# Altium schematic sheet FPGA_DDR.SchDoc
size A4; SheetNumber: 2; SheetTotal: 9
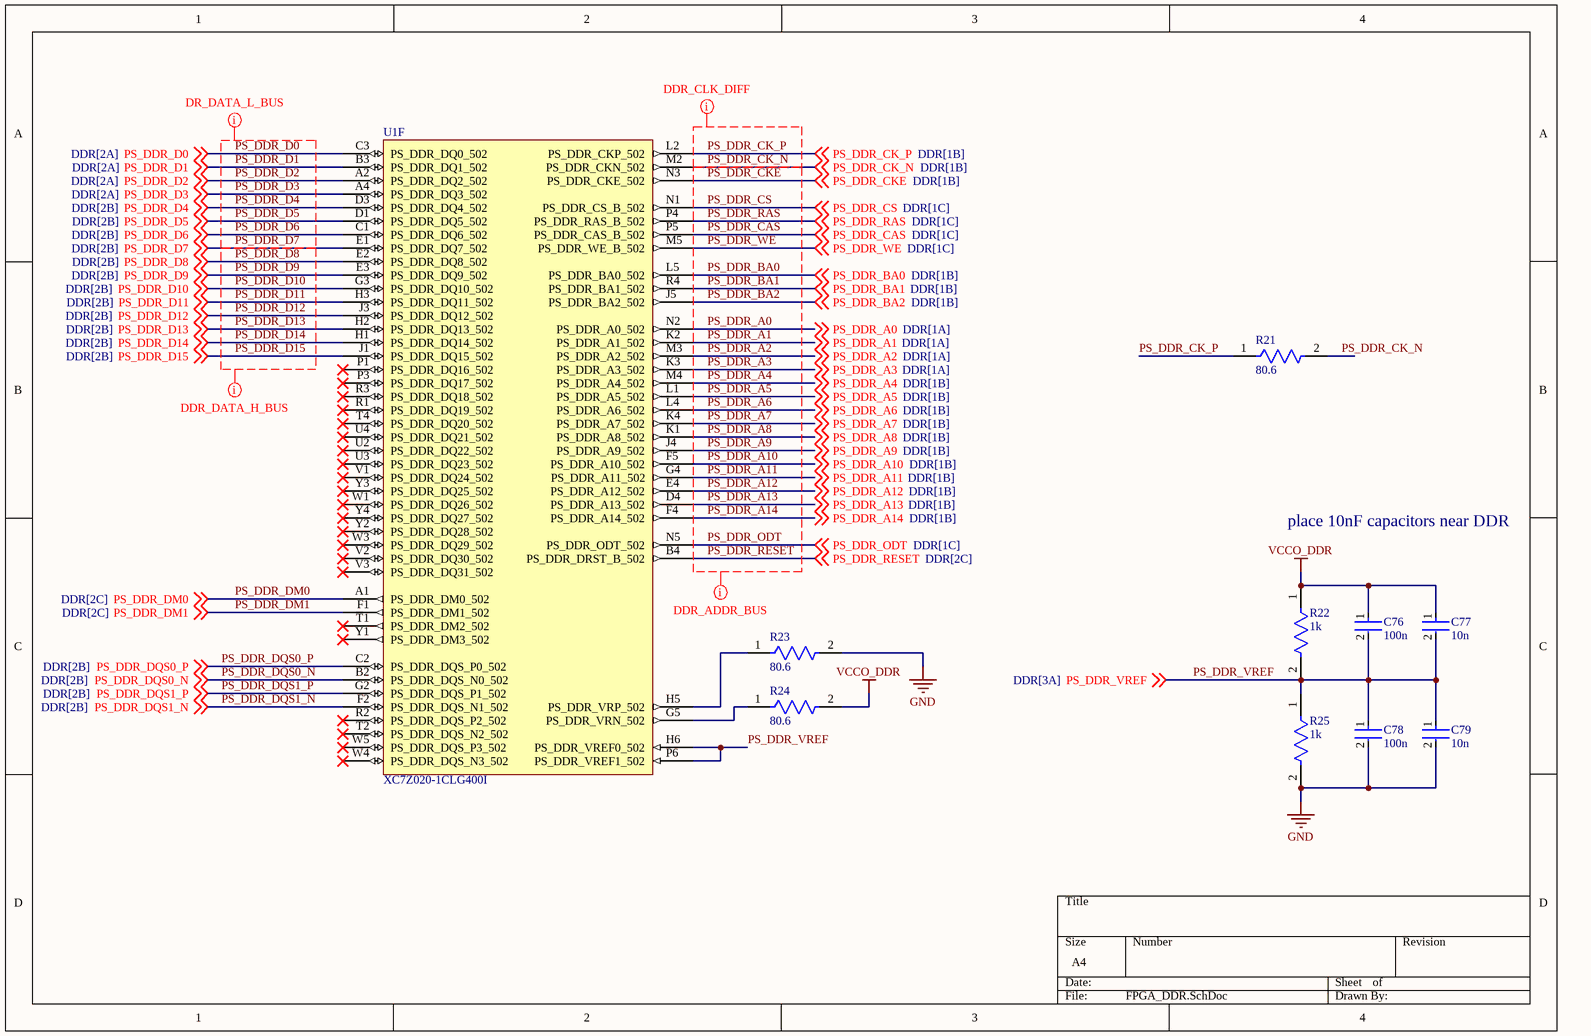
[diagram p0: FPGA_DDR.SchDoc]

## Parts
C76  100n  [FP-CC0603-DA-MFG]
C77  10n  [FP-CC0603-DA-MFG]
C78  100n  [FP-CC0603-DA-MFG]
C79  10n  [FP-CC0603-DA-MFG]
R21  80.6  [FP-RT0402-MFG]
R22  1k  [FP-RC0603-0_55-IPC_C]
R23  80.6  [FP-RT0603-MFG]
R24  80.6  [FP-RT0603-MFG]
R25  1k  [FP-RC0603-0_55-IPC_C]
U1  XC7Z020-1CLG400I  [CLG400]  (part F of 9)

## Nets
GND: C78.2 C79.2 R23.2 R25.2
VCCO_DDR: C76.1 C77.1 R22.1 R24.2
PS_DDR_A0: U1.N2(PS_DDR_A0_502) ; off-sheet PS_DDR_A0
PS_DDR_A1: U1.K2(PS_DDR_A1_502) ; off-sheet PS_DDR_A1
PS_DDR_A2: U1.M3(PS_DDR_A2_502) ; off-sheet PS_DDR_A2
PS_DDR_A3: U1.K3(PS_DDR_A3_502) ; off-sheet PS_DDR_A3
PS_DDR_A4: U1.M4(PS_DDR_A4_502) ; off-sheet PS_DDR_A4
PS_DDR_A5: U1.L1(PS_DDR_A5_502) ; off-sheet PS_DDR_A5
PS_DDR_A6: U1.L4(PS_DDR_A6_502) ; off-sheet PS_DDR_A6
PS_DDR_A7: U1.K4(PS_DDR_A7_502) ; off-sheet PS_DDR_A7
PS_DDR_A8: U1.K1(PS_DDR_A8_502) ; off-sheet PS_DDR_A8
PS_DDR_A9: U1.J4(PS_DDR_A9_502) ; off-sheet PS_DDR_A9
PS_DDR_A10: U1.F5(PS_DDR_A10_502) ; off-sheet PS_DDR_A10
PS_DDR_A11: U1.G4(PS_DDR_A11_502) ; off-sheet PS_DDR_A11
PS_DDR_A12: U1.E4(PS_DDR_A12_502) ; off-sheet PS_DDR_A12
PS_DDR_A13: U1.D4(PS_DDR_A13_502) ; off-sheet PS_DDR_A13
PS_DDR_A14: U1.F4(PS_DDR_A14_502) ; off-sheet PS_DDR_A14
PS_DDR_BA0: U1.L5(PS_DDR_BA0_502) ; off-sheet PS_DDR_BA0
PS_DDR_BA1: U1.R4(PS_DDR_BA1_502) ; off-sheet PS_DDR_BA1
PS_DDR_BA2: U1.J5(PS_DDR_BA2_502) ; off-sheet PS_DDR_BA2
PS_DDR_CAS: U1.P5(PS_DDR_CAS_B_502) ; off-sheet PS_DDR_CAS
PS_DDR_CK_N: R21.2 U1.M2(PS_DDR_CKN_502) ; off-sheet PS_DDR_CK_N
PS_DDR_CK_P: R21.1 U1.L2(PS_DDR_CKP_502) ; off-sheet PS_DDR_CK_P
PS_DDR_CKE: U1.N3(PS_DDR_CKE_502) ; off-sheet PS_DDR_CKE
PS_DDR_CS: U1.N1(PS_DDR_CS_B_502) ; off-sheet PS_DDR_CS
PS_DDR_D0: U1.C3(PS_DDR_DQ0_502) ; off-sheet PS_DDR_D0
PS_DDR_D1: U1.B3(PS_DDR_DQ1_502) ; off-sheet PS_DDR_D1
PS_DDR_D2: U1.A2(PS_DDR_DQ2_502) ; off-sheet PS_DDR_D2
PS_DDR_D3: U1.A4(PS_DDR_DQ3_502) ; off-sheet PS_DDR_D3
PS_DDR_D4: U1.D3(PS_DDR_DQ4_502) ; off-sheet PS_DDR_D4
PS_DDR_D5: U1.D1(PS_DDR_DQ5_502) ; off-sheet PS_DDR_D5
PS_DDR_D6: U1.C1(PS_DDR_DQ6_502) ; off-sheet PS_DDR_D6
PS_DDR_D7: U1.E1(PS_DDR_DQ7_502) ; off-sheet PS_DDR_D7
PS_DDR_D8: U1.E2(PS_DDR_DQ8_502) ; off-sheet PS_DDR_D8
PS_DDR_D9: U1.E3(PS_DDR_DQ9_502) ; off-sheet PS_DDR_D9
PS_DDR_D10: U1.G3(PS_DDR_DQ10_502) ; off-sheet PS_DDR_D10
PS_DDR_D11: U1.H3(PS_DDR_DQ11_502) ; off-sheet PS_DDR_D11
PS_DDR_D12: U1.J3(PS_DDR_DQ12_502) ; off-sheet PS_DDR_D12
PS_DDR_D13: U1.H2(PS_DDR_DQ13_502) ; off-sheet PS_DDR_D13
PS_DDR_D14: U1.H1(PS_DDR_DQ14_502) ; off-sheet PS_DDR_D14
PS_DDR_D15: U1.J1(PS_DDR_DQ15_502) ; off-sheet PS_DDR_D15
PS_DDR_DM0: U1.A1(PS_DDR_DM0_502) ; off-sheet PS_DDR_DM0
PS_DDR_DM1: U1.F1(PS_DDR_DM1_502) ; off-sheet PS_DDR_DM1
PS_DDR_DQS0_N: U1.B2(PS_DDR_DQS_N0_502) ; off-sheet PS_DDR_DQS0_N
PS_DDR_DQS0_P: U1.C2(PS_DDR_DQS_P0_502) ; off-sheet PS_DDR_DQS0_P
PS_DDR_DQS1_N: U1.F2(PS_DDR_DQS_N1_502) ; off-sheet PS_DDR_DQS1_N
PS_DDR_DQS1_P: U1.G2(PS_DDR_DQS_P1_502) ; off-sheet PS_DDR_DQS1_P
PS_DDR_ODT: U1.N5(PS_DDR_ODT_502) ; off-sheet PS_DDR_ODT
PS_DDR_RAS: U1.P4(PS_DDR_RAS_B_502) ; off-sheet PS_DDR_RAS
PS_DDR_RESET: U1.B4(PS_DDR_DRST_B_502) ; off-sheet PS_DDR_RESET
PS_DDR_VREF: C76.2 C77.2 C78.1 C79.1 R22.2 R25.1 U1.H6(PS_DDR_VREF0_502) U1.P6(PS_DDR_VREF1_502) ; off-sheet PS_DDR_VREF
PS_DDR_WE: U1.M5(PS_DDR_WE_B_502) ; off-sheet PS_DDR_WE
NetR23_1: R23.1 U1.H5(PS_DDR_VRP_502)
NetR24_1: R24.1 U1.G5(PS_DDR_VRN_502)

Not connected (* = marked no-connect by the designer): U1 P1(PS_DDR_DQ16_502)* P3(PS_DDR_DQ17_502)* R1(PS_DDR_DQ19_502)* R2(PS_DDR_DQS_P2_502)* R3(PS_DDR_DQ18_502)* T1(PS_DDR_DM2_502)* T2(PS_DDR_DQS_N2_502)* T4(PS_DDR_DQ20_502)* U2(PS_DDR_DQ22_502)* U3(PS_DDR_DQ23_502)* U4(PS_DDR_DQ21_502)* V1(PS_DDR_DQ24_502)* V2(PS_DDR_DQ30_502)* V3(PS_DDR_DQ31_502)* W1(PS_DDR_DQ26_502)* W3(PS_DDR_DQ29_502)* W4(PS_DDR_DQS_N3_502)* W5(PS_DDR_DQS_P3_502)* Y1(PS_DDR_DM3_502)* Y2(PS_DDR_DQ28_502)* Y3(PS_DDR_DQ25_502)* Y4(PS_DDR_DQ27_502)*

## Layout directives
mark named DDR_CLK_DIFF: PS_DDR_CK_N, PS_DDR_CK_P
mark named DDR_ADDR_BUS: PS_DDR_A0, PS_DDR_A1, PS_DDR_A2, PS_DDR_A3, PS_DDR_A4, PS_DDR_A5, PS_DDR_A6, PS_DDR_A7, PS_DDR_A8, PS_DDR_A9, PS_DDR_A10, PS_DDR_A11, PS_DDR_A12, PS_DDR_A13, PS_DDR_A14, PS_DDR_BA0, PS_DDR_BA1, PS_DDR_BA2, PS_DDR_CAS, PS_DDR_CK_N, PS_DDR_CKE, PS_DDR_CS, PS_DDR_ODT, PS_DDR_RAS, PS_DDR_RESET, PS_DDR_WE
mark named DDR_DATA_H_BUS: PS_DDR_D7, PS_DDR_D8, PS_DDR_D9, PS_DDR_D10, PS_DDR_D11, PS_DDR_D12, PS_DDR_D13, PS_DDR_D14, PS_DDR_D15
mark named DR_DATA_L_BUS: PS_DDR_D0, PS_DDR_D1, PS_DDR_D2, PS_DDR_D3, PS_DDR_D4, PS_DDR_D5, PS_DDR_D6, PS_DDR_D7

## Notes on the sheet
- place 10nF capacitors near DDR

## Library data of the parts
C76 C78 = CMP-2100-03601-2: CAP CER 0.1UF 50V X7R 0603; Manufacturer: YAGEO; Manufacturer Part Number: CC0603KRX7R9BB104; Material: Ceramic; Capacitance: 100 nF; Temperature Coefficient: 15%; Tolerance: 0.1; Value: 100 nF; Height: 0.9mm; Voltage: 50 V; ComponentLink2Description: Datasheet; Device Class L2: Capacitors; Temperature Range High: +125°C; Category: Cap; Footprint Url: http://www.yageo.com/exep/pages/download/literatures/UPY-C_GEN_24.pdf; ComponentLink2URL: http://www.yageo.com/documents/recent/UPY-GPHC_X7R_6.3V-to-50V_18.pdf; Package: CC0603-DA; Temperature: -55°C to +125°C; Voltage Rating: 50 V; Temperature Characteristic: X7R; Device Class L1: Passive Components; Temperature Range Low: -55°C; RoHS: TRUE; Automotive: No; Device Class L3: Ceramic Capacitors; Octopart: https://octopart.com/cc0603krx7r9bb104-yageo-42244635; Mouser Description: Multilayer Ceramic Capacitor, CC Series, 0.1 - F, - 10%, X7R, 50 V, 0603 [1608 Metric]; Lead Free: Yes; Digikey Description: CAP CER 0.1UF 50V X7R 0603
C77 C79 = CMP-2100-03600-2: CAP CER 10000PF 50V X7R 0603; Manufacturer Part Number: CC0603KRX7R9BB103; Manufacturer: YAGEO; Tolerance: 0.1; Material: Ceramic; Temperature Coefficient: 15%; Value: 10 nF; Mouser Description: Multilayer Ceramic Capacitor, CC Series, 0.01 - F, - 10%, X7R, 50 V, 0603 [1608 Metric]; Digikey Description: CAP CER 10000PF 50V X7R 0603; Height: 0.9mm; Category: Cap; Temperature Characteristic: X7R; Footprint Url: http://www.yageo.com/exep/pages/download/literatures/UPY-C_GEN_24.pdf; Lead Free: Yes; Voltage Rating: 50 V; Temperature: -55°C to +125°C; Device Class L3: Ceramic Capacitors; ComponentLink2Description: Datasheet; Voltage: 50 V; Package: CC0603-DA; Octopart: https://octopart.com/cc0603krx7r9bb103-yageo-192938; Automotive: No; Temperature Range High: +125°C; Temperature Range Low: -55°C; RoHS: TRUE; Device Class L1: Passive Components; ComponentLink2URL: http://www.yageo.com/documents/recent/UPY-GPHC_X7R_6.3V-to-50V_18.pdf; Device Class L2: Capacitors; Capacitance: 10 nF
R21 = CMP-2002-02816-2: RES SMD 80.6 OHM 0.1% 1/16W 0402; Manufacturer: Yageo; Manufacturer Part Number: RT0402BRD0780R6L; Description: RT0402 80.6Ω 0.063W 25 ppm/°C 0.10%; Resistance: 80.6Ω; Voltage Rating: 50V; Power Rating: 0.063W; Value: 80.6Ω; Tolerance: 0.001; Temperature Coefficient: 25 ppm/°C; ComponentLink2Description: Datasheet; Mouser Description: Thin Film Resistors 1/16W 80.6 ohm .1% 25ppm; Series: RT; Category: Res; Device Class L1: Passive Components; Package: RT0402; Digikey Description: RES SMD 80.6 OHM 0.1% 1/16W 0402; Temperature: -55°C to +155°C; Octopart: https://octopart.com/rt0402brd0780r6l-yageo-1195311; Temperature Range High: +155°C; Device Class L3: Chip SMD Resistors; Lead Free: Yes; Device Class L2: Resistors; Footprint Url: http://www.yageo.com/exep/pages/download/literatures/PYu-R_Mount_10.pdf; Temperature Range Low: -55°C; Ipc Land Pattern Name: RESC10050X30; RoHS: TRUE; Automotive: No; Height: 0.35mm; ComponentLink2URL: http://www.yageo.com/documents/recent/PYu-RT_1-to-0.01_RoHS_L_9.pdf; Composition: Thin Film
R22 R25 = CMP-1659-00009-5: RES 1K OHM 1% 1/10W 0603; Resistance: 1kR; Voltage Rating: 50V; Power Rating: 100mW; Temperature Coefficient: 100ppm/°C; Military Standard: Not; REACH SVHC: No SVHC; Size Code: 0603; Features: Moisture Resistant; Number of Terminations: 2; Technology: THICK FILM; Series: RC; Case Code (Metric): 1608; Resistance Tolerance: 1%; Resistor Type: Thick Film; Termination: SMD/SMT; Contact Plating: Tin; Radiation Hardening: No; Min Operating Temperature: -55°C; Max Operating Temperature: 155°C; Packaging: Tape and Reel; Max Power Dissipation: 100mW; RoHS Compliant: Yes; Height: 0.45mm; Lead Free: Lead Free; Case/Package: 0603; Length: 1.6mm; Tolerance: 1%; Case Code (Imperial): 0603; Construction: Rectangular; Depth: 0.8mm
R23 R24 = CMP-03412-036205-1: RES SMD 80.6 OHM 0.1% 1/10W 0603; Manufacturer Part Number: RT0603BRB0780R6L; Manufacturer: Yageo; Temperature Coefficient: 10 ppm/°C; Resistance: 80.6Ω; Tolerance: 0.001; Voltage Rating: 75V; Power Rating: 0.1W; Value: 80.6Ω; RoHS: TRUE; Temperature Range Low: -55°C; Digikey Description: RES SMD 80.6 OHM 0.1% 1/10W 0603; Temperature: -55°C to +155°C; Package: RT0603; Device Class L3: Chip SMD Resistors; Automotive: No; ComponentLink2Description: Datasheet; Series: RT; Footprint Url: http://www.yageo.com/exep/pages/download/literatures/PYu-R_Mount_10.pdf; Device Class L1: Passive Components; Ipc Land Pattern Name: RESC16080X45; Lead Free: Yes; Category: Res; Height: 0.55mm; Composition: Thin Film; Device Class L2: Resistors; Temperature Range High: +155°C; ComponentLink2URL: http://www.yageo.com/documents/recent/PYu-RT_1-to-0.01_RoHS_L_9.pdf; Octopart: https://octopart.com/rt0603brb0780r6l-yageo-71393764
U1 = CMP-0363-00001-3: 667 MHz Zynq™-7000 AP SoC, 130 PS I/O, 125 FPGA I/O, 400-Ball BGA, Speed Grade 1, Industrial Grade, Pb-Free; LUTs: 53200; Flip Flops: 106400; Extensible Block RAM (# 36Kb Blocks): 560 KB (140); Speed Grade: -1; RoHS: Pb-Free; ComponentLink3Description: DC and AC Switching Characteristics; ComponentLink6Description: PCB and Layout Guide; ComponentLink1Description: Datasheet; ComponentLink4URL: http://www.xilinx.com/support/packagefiles/z7packages/xc7z020clg400pkg.txt; ComponentLink2Description: Package Specification; PackageReference: CLG400; ComponentLink4Description: Package File; Generic Part Number: XC7Z020; ComponentLink6URL: http://www.xilinx.com/support/documentation/user_guides/ug483_7Series_PCB.pdf; PackageVersion: Rev 1.1, 09/2012; PartNumber: XC7Z020-1CLG400I; PackageDescription: Wire-Bond Chip-Scale BGA, Body 17 x 17 mm, 0.8 mm Pitch; ComponentLink5Description: Packaging and Pinout; ComponentLink2URL: http://www.xilinx.com/support/documentation/user_guides/ug865-Zynq-7000-Pkg-Pinout.pdf; ComponentLink5URL: http://www.xilinx.com/support/documentation/user_guides/ug865-Zynq-7000-Pkg-Pinout.pdf; DatasheetVersion: v1.2; Code_JEDEC: MO-275-MMAA-1; Mounting Technology: Surface Mount; ComponentLink3URL: http://www.xilinx.com/support/documentation/data_sheets/ds187-XC7Z010-XC7Z020-Data-Sheet.pdf; ComponentLink1URL: http://www.xilinx.com/support/documentation/data_sheets/ds190-Zynq-7000-Overview.pdf